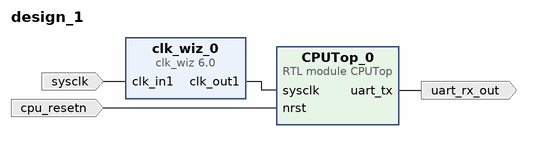
[diagram p0: block diagram of the top level]
# Vivado block design design_1, xc7a200tsbg484-1, Vivado 2020.2
create_bd_design design_1

create_bd_port -dir I -type clk sysclk
set_property -dict {CONFIG.FREQ_HZ 100000000} [get_bd_ports sysclk]
create_bd_port -dir I cpu_resetn
create_bd_port -dir O uart_rx_out

create_bd_cell -type ip -vlnv xilinx.com:ip:clk_wiz:6.0 clk_wiz_0
set_property -dict [list \
  CONFIG.CLKOUT1_JITTER 140.709 \
  CONFIG.CLKOUT1_PHASE_ERROR 105.461 \
  CONFIG.CLKOUT1_REQUESTED_DUTY_CYCLE 40 \
  CONFIG.CLKOUT1_REQUESTED_OUT_FREQ 90 \
  CONFIG.CLKOUT2_JITTER 140.709 \
  CONFIG.CLKOUT2_PHASE_ERROR 105.461 \
  CONFIG.CLKOUT2_REQUESTED_OUT_FREQ 90 \
  CONFIG.CLKOUT2_REQUESTED_PHASE 90 \
  CONFIG.CLKOUT2_USED false \
  CONFIG.CLK_IN1_BOARD_INTERFACE sys_clock \
  CONFIG.MMCM_CLKFBOUT_MULT_F 9.000 \
  CONFIG.MMCM_CLKOUT0_DIVIDE_F 10.000 \
  CONFIG.MMCM_CLKOUT0_DUTY_CYCLE 0.400 \
  CONFIG.MMCM_CLKOUT1_DIVIDE 1 \
  CONFIG.MMCM_CLKOUT1_PHASE 90.000 \
  CONFIG.MMCM_DIVCLK_DIVIDE 1 \
  CONFIG.NUM_OUT_CLKS 1 \
  CONFIG.USE_LOCKED false \
  CONFIG.USE_RESET false \
] [get_bd_cells clk_wiz_0]
create_bd_cell -type module -reference CPUTop CPUTop_0

# ---- connections ----

connect_bd_net [get_bd_pins clk_wiz_0/clk_out1] [get_bd_pins CPUTop_0/sysclk]
connect_bd_net [get_bd_ports sysclk] [get_bd_pins clk_wiz_0/clk_in1]
connect_bd_net [get_bd_ports cpu_resetn] [get_bd_pins CPUTop_0/nrst]
connect_bd_net [get_bd_pins CPUTop_0/uart_tx] [get_bd_ports uart_rx_out]

validate_bd_design
save_bd_design
